# EAGLE schematic temp-battery-board (EAGLE 6.2)
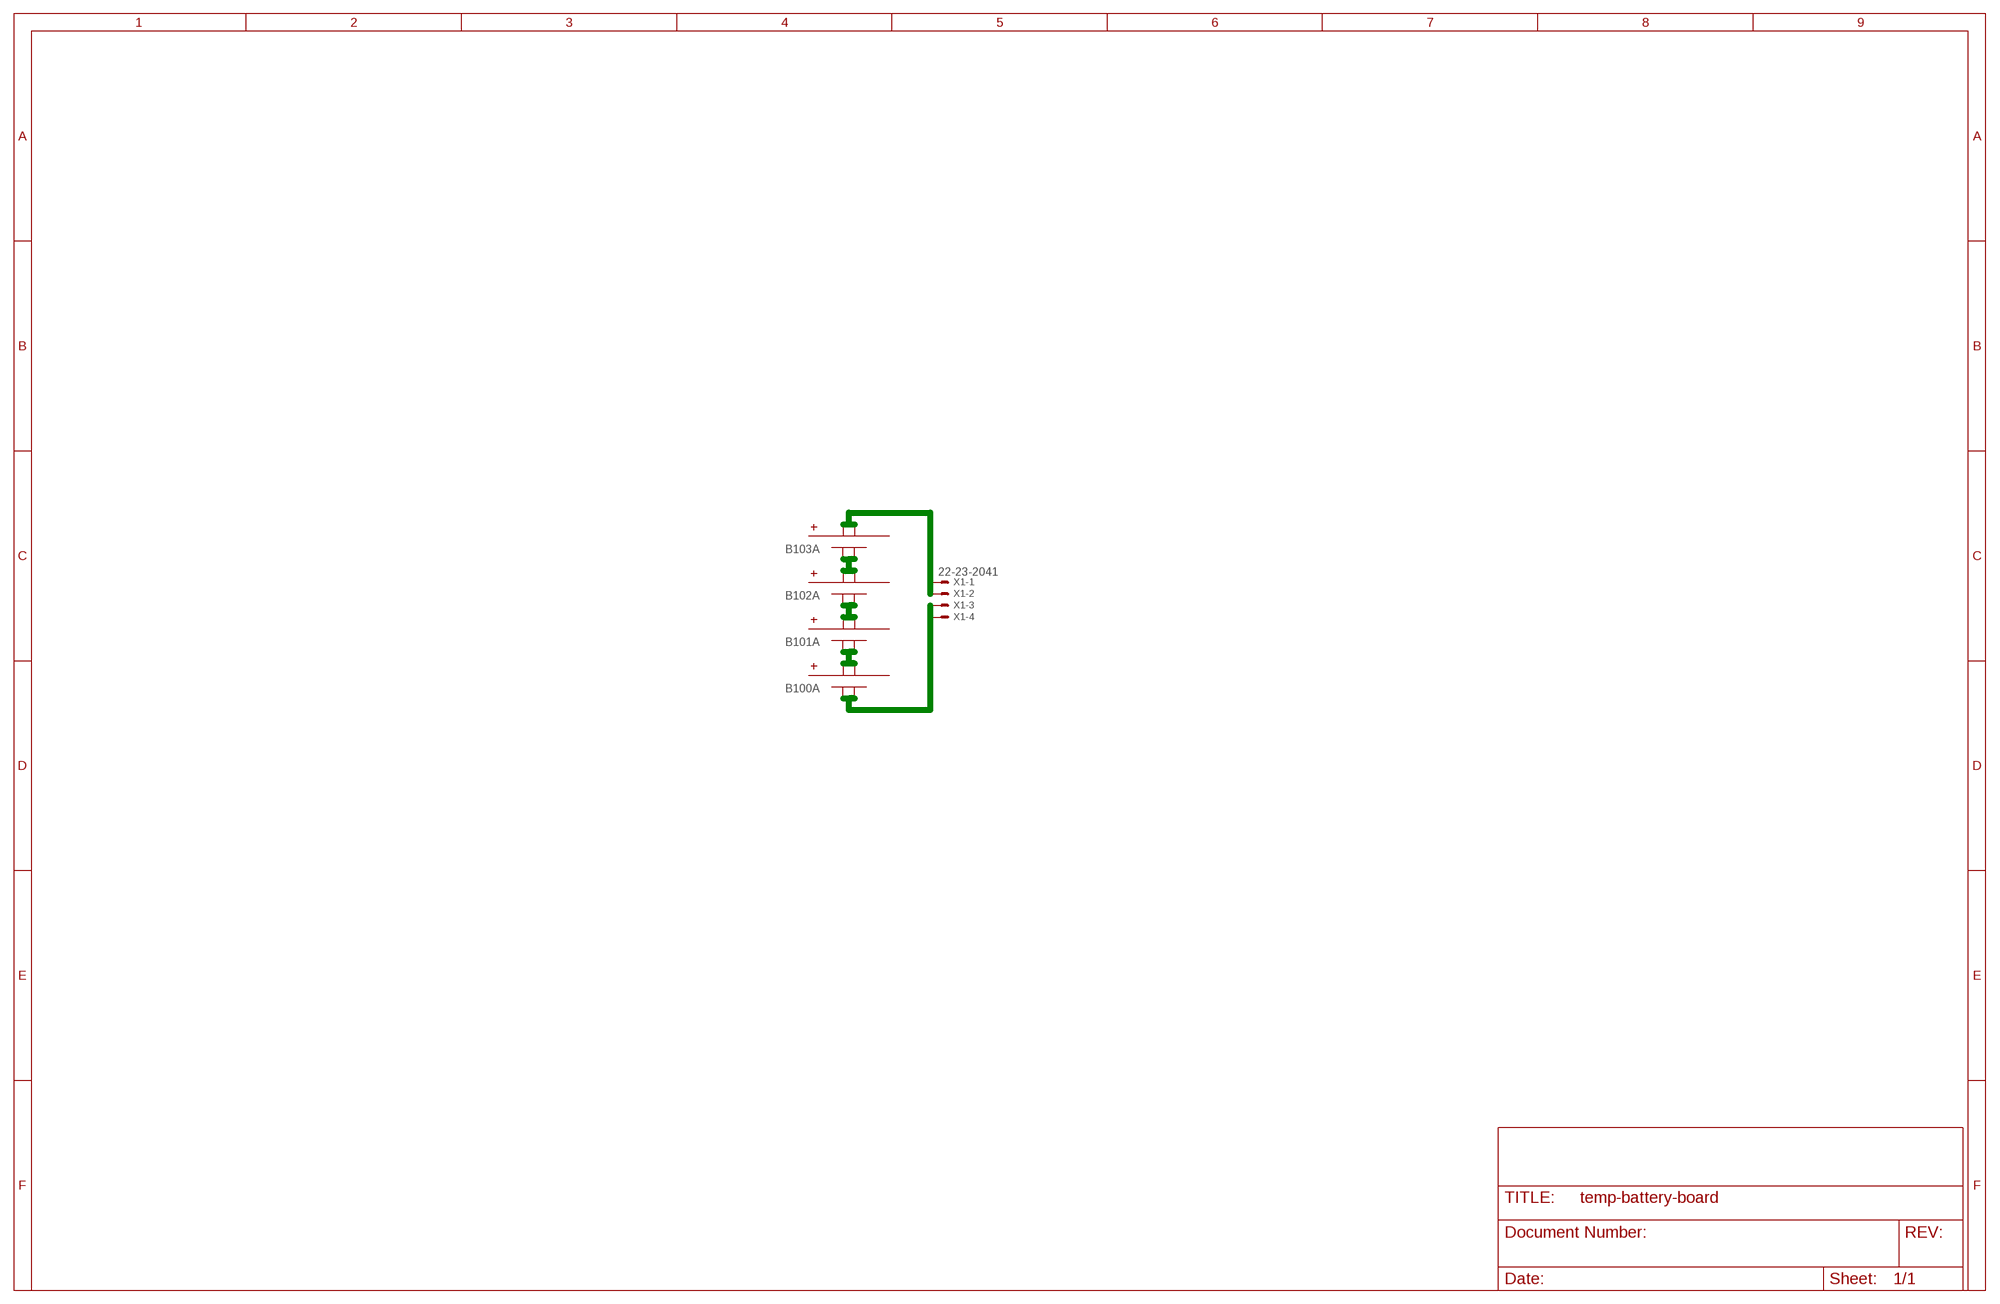
[diagram p0: schematic, sheet 1]

## Parts
B100A  LIPO-8AHR  [LIPO-8AHR-PAC]
B101A  LIPO-8AHR  [LIPO-8AHR-PAC]
B102A  LIPO-8AHR  [LIPO-8AHR-PAC]
B103A  LIPO-8AHR  [LIPO-8AHR-PAC]
X1  22-23-2041  [22-23-2041]

## Nets
B2-B3: B101A.B+@1(B+) B101A.B+@2(B+) B102A.B-@1(B-) B102A.B-@2(B-)
B3-B4: B102A.B+@1(B+) B102A.B+@2(B+) B103A.B-@1(B-) B103A.B-@2(B-)
B+: B103A.B+@1(B+) B103A.B+@2(B+) X1.1 X1.2
B-: B100A.B-@1(B-) B100A.B-@2(B-) X1.3 X1.4
N$7: B100A.B+@1(B+) B100A.B+@2(B+) B101A.B-@1(B-) B101A.B-@2(B-)

## Library data of the parts
B100A B101A B102A B103A = battery:LIPO-8AHR
X1 = con-molex:22-23-2041: .100" (2.54mm) Center Header - 4 Pin